# Altium project Apollo_FPC_Key.PrjPcb
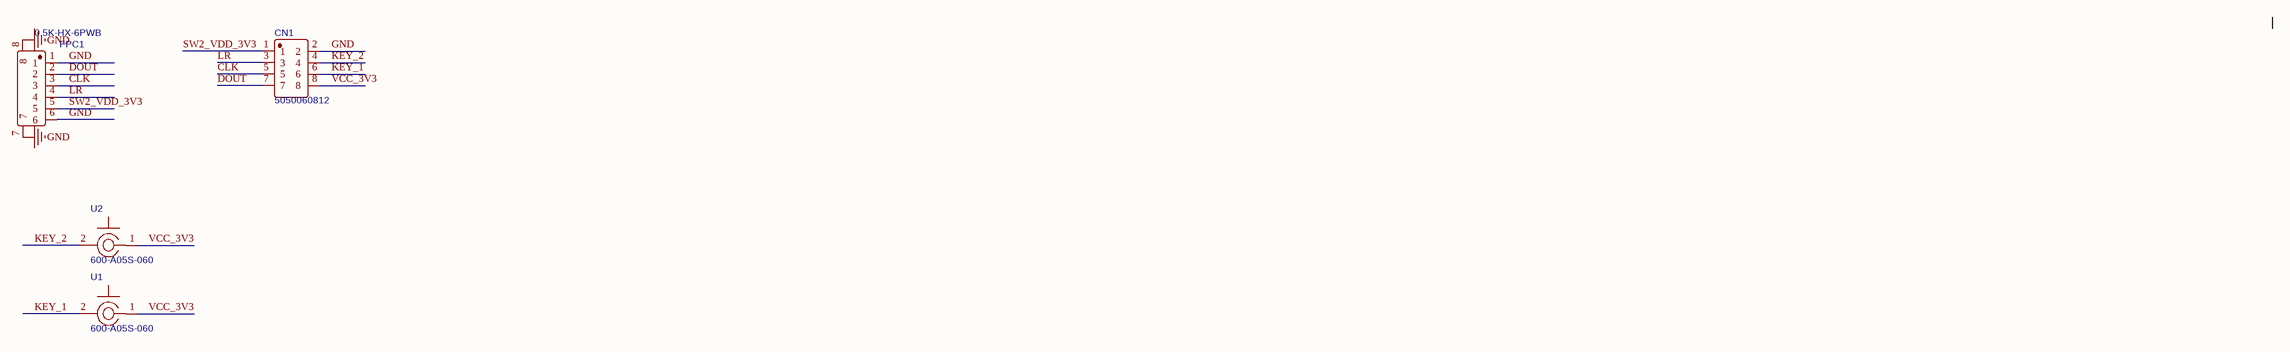
[diagram p0: FPC_KEY.SchDoc]
1 sheet, 4 parts. Net scope: global (net labels, ports and power ports of the same name join across sheets).
Board file: FPC_KEY.PcbDoc

## Sheet FPC_KEY.SchDoc
size A2; SheetNumber: 1; SheetTotal: 1

### Parts
CN1  5050060812  [CONN-SMD_5050060810]
FPC1  0.5K-HX-6PWB  [FPC-SMD_6P-P0.50_HDGC_0.5K-HX-6PWB]
U1  600-A05S-060  [SW-SMD_BD2.50-600-A05S-060]
U2  600-A05S-060  [SW-SMD_BD2.50-600-A05S-060]

### Nets
GND: CN1.2 FPC1.1 FPC1.6 FPC1.7 FPC1.8
CLK: CN1.5 FPC1.3
DOUT: CN1.7 FPC1.2
KEY_1: CN1.6 U1.2
KEY_2: CN1.4 U2.2
LR: CN1.3 FPC1.4
SW2_VDD_3V3: CN1.1 FPC1.5
VCC_3V3: CN1.8 U1.1 U2.1

### Library data of the parts
CN1 = 5050060812_8pin_DP: Manufacturer: MOLEX; Contributor: lcsc; Supplier: LCSC; Supplier Part: C779875; Manufacturer Part: 5050060812; JLCPCB Part Class: Extended Part; spicePre: C; spiceSymbolName: 5050060812
FPC1 = 0.5K-HX-6PWB: Manufacturer: HDGC(华德共创); Contributor: LCSC; Supplier: LCSC; Supplier Part: C2919491; Manufacturer Part: 0.5K-HX-6PWB; JLCPCB Part Class: Extended Part; spicePre: F; spiceSymbolName: 0.5K-HX-6PWB
U1 U2 = 600-A05S-060: Manufacturer: HYP(鸿源精密); Contributor: lcsc; Supplier: LCSC; Supplier Part: C256183; Manufacturer Part: 600-A05S-060; JLCPCB Part Class: Extended Part; spicePre: U; spiceSymbolName: 600-A05S-060